# Altium schematic sheet Sheet6.SchDoc
size A3; SheetNumber: 6; SheetTotal: 6
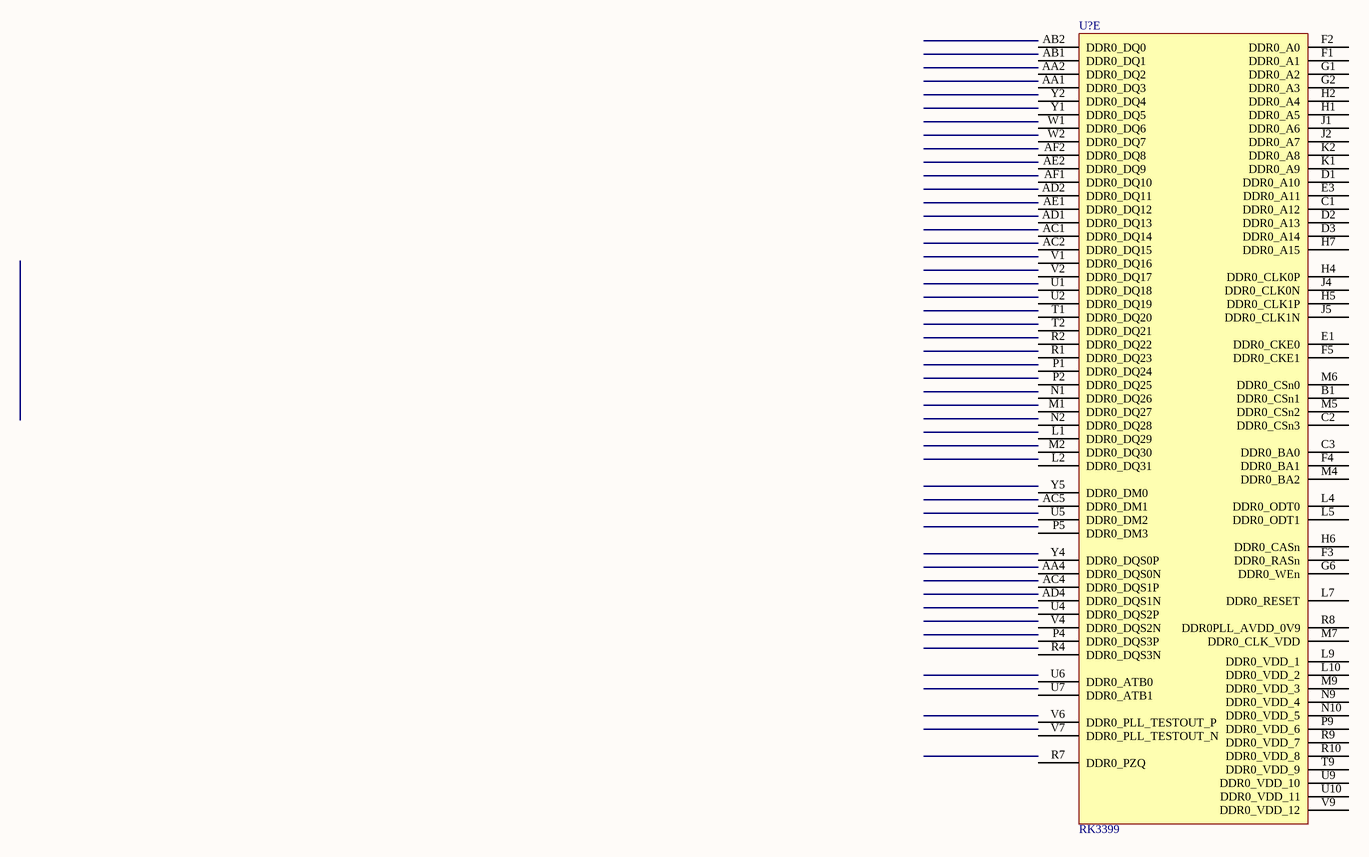
[diagram p0: Sheet6.SchDoc]

## Parts
U?  RK3399  [FBGA828_23_826X826]  (part E of 24)

## Nets

Not connected (* = marked no-connect by the designer): U? AA1(DDR0_DQ3) AA2(DDR0_DQ2) AA4(DDR0_DQS0N) AB1(DDR0_DQ1) AB2(DDR0_DQ0) AC1(DDR0_DQ14) AC2(DDR0_DQ15) AC4(DDR0_DQS1P) AC5(DDR0_DM1) AD1(DDR0_DQ13) AD2(DDR0_DQ11) AD4(DDR0_DQS1N) AE1(DDR0_DQ12) AE2(DDR0_DQ9) AF1(DDR0_DQ10) AF2(DDR0_DQ8) B1(DDR0_CSn1) C1(DDR0_A12) C2(DDR0_CSn3) C3(DDR0_BA0) D1(DDR0_A10) D2(DDR0_A13) D3(DDR0_A14) E1(DDR0_CKE0) E3(DDR0_A11) F1(DDR0_A1) F2(DDR0_A0) F3(DDR0_RASn) F4(DDR0_BA1) F5(DDR0_CKE1) G1(DDR0_A2) G2(DDR0_A3) G6(DDR0_WEn) H1(DDR0_A5) H2(DDR0_A4) H4(DDR0_CLK0P) H5(DDR0_CLK1P) H6(DDR0_CASn) H7(DDR0_A15) J1(DDR0_A6) J2(DDR0_A7) J4(DDR0_CLK0N) J5(DDR0_CLK1N) K1(DDR0_A9) K2(DDR0_A8) L1(DDR0_DQ29) L2(DDR0_DQ31) L4(DDR0_ODT0) L5(DDR0_ODT1) L7(DDR0_RESET) L9(DDR0_VDD_1) L10(DDR0_VDD_2) M1(DDR0_DQ27) M2(DDR0_DQ30) M4(DDR0_BA2) M5(DDR0_CSn2) M6(DDR0_CSn0) M7(DDR0_CLK_VDD) M9(DDR0_VDD_3) N1(DDR0_DQ26) N2(DDR0_DQ28) N9(DDR0_VDD_4) N10(DDR0_VDD_5) P1(DDR0_DQ24) P2(DDR0_DQ25) P4(DDR0_DQS3P) P5(DDR0_DM3) P9(DDR0_VDD_6) R1(DDR0_DQ23) R2(DDR0_DQ22) R4(DDR0_DQS3N) R7(DDR0_PZQ) R8(DDR0PLL_AVDD_0V9) R9(DDR0_VDD_7) R10(DDR0_VDD_8) T1(DDR0_DQ20) T2(DDR0_DQ21) T9(DDR0_VDD_9) U1(DDR0_DQ18) U2(DDR0_DQ19) U4(DDR0_DQS2P) U5(DDR0_DM2) U6(DDR0_ATB0) U7(DDR0_ATB1) U9(DDR0_VDD_10) U10(DDR0_VDD_11) V1(DDR0_DQ16) V2(DDR0_DQ17) V4(DDR0_DQS2N) V6(DDR0_PLL_TESTOUT_P) V7(DDR0_PLL_TESTOUT_N) V9(DDR0_VDD_12) W1(DDR0_DQ6) W2(DDR0_DQ7) Y1(DDR0_DQ5) Y2(DDR0_DQ4) Y4(DDR0_DQS0P) Y5(DDR0_DM0)

## Library data of the parts
U? = IC_RK3399-FCBGA828: RK3399 is a low power, high performance processor for computing, personal mobile.; Manufacturer: Rockchip; Manufacturer Part Number: RK3399; Case/Package: FCBGA828; Supplier-1: Rockchip